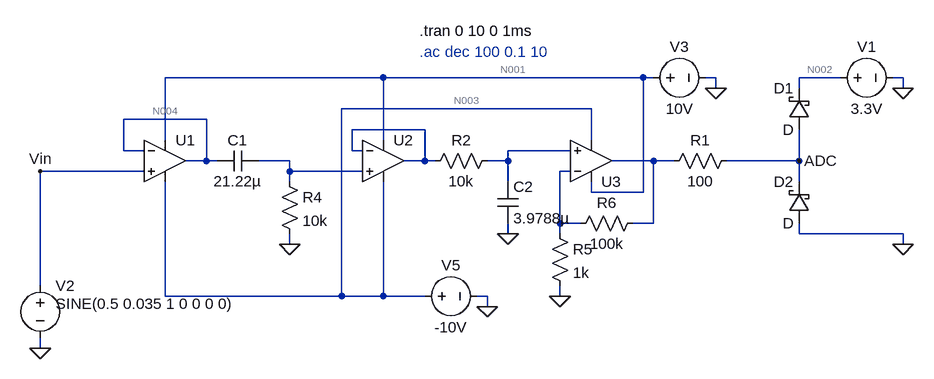
[diagram p0: schematic Lab8.asc]
Lab8.asc, the LTspice schematic file:
Version 4
SHEET 1 880 680
WIRE -128 -48 -464 -48
WIRE 272 -48 -128 -48
WIRE 288 -48 272 -48
WIRE 384 -48 368 -48
WIRE 576 -48 512 -48
WIRE 672 -48 656 -48
WIRE 384 -32 384 -48
WIRE 512 -32 512 -48
WIRE 672 -32 672 -48
WIRE 192 0 -192 0
WIRE -400 16 -528 16
WIRE -64 32 -176 32
WIRE -464 48 -464 -48
WIRE -128 48 -128 -48
WIRE 192 48 192 0
WIRE -528 64 -528 16
WIRE -496 64 -528 64
WIRE -176 64 -176 32
WIRE -160 64 -176 64
WIRE 160 64 64 64
WIRE -400 80 -400 16
WIRE -400 80 -432 80
WIRE -384 80 -400 80
WIRE -272 80 -320 80
WIRE -64 80 -64 32
WIRE -64 80 -96 80
WIRE -48 80 -64 80
WIRE 64 80 64 64
WIRE 64 80 32 80
WIRE 288 80 224 80
WIRE 320 80 288 80
WIRE 512 80 512 32
WIRE 512 80 400 80
WIRE -496 96 -656 96
WIRE -272 96 -272 80
WIRE -160 96 -272 96
WIRE 160 96 144 96
WIRE -272 112 -272 96
WIRE 64 112 64 80
WIRE 512 112 512 80
WIRE 192 128 192 112
WIRE 272 128 272 -48
WIRE 272 128 192 128
WIRE 144 176 144 96
WIRE 176 176 144 176
WIRE 288 176 288 80
WIRE 288 176 256 176
WIRE 64 192 64 176
WIRE 144 192 144 176
WIRE 512 192 512 176
WIRE 672 192 512 192
WIRE -272 208 -272 192
WIRE 672 208 672 192
WIRE -656 272 -656 96
WIRE -464 288 -464 112
WIRE -192 288 -192 0
WIRE -192 288 -464 288
WIRE -128 288 -128 112
WIRE -128 288 -192 288
WIRE -64 288 -128 288
WIRE 32 288 16 288
WIRE 144 288 144 272
WIRE 32 304 32 288
WIRE -656 368 -656 352
FLAG 672 208 0
FLAG 672 -32 0
FLAG -272 208 0
FLAG 64 192 0
FLAG 144 288 0
FLAG 512 80 ADC
FLAG 384 -32 0
FLAG 32 304 0
FLAG -656 368 0
FLAG -656 96 Vin
SYMBOL schottky 528 176 R180
WINDOW 0 24 64 Left 2
WINDOW 3 24 0 Left 2
SYMATTR InstName D2
SYMBOL schottky 528 32 R180
WINDOW 0 24 64 Left 2
WINDOW 3 24 0 Left 2
SYMATTR InstName D1
SYMBOL res 416 64 R90
WINDOW 0 0 56 VBottom 2
WINDOW 3 32 56 VTop 2
SYMATTR InstName R1
SYMATTR Value 100
SYMBOL voltage 560 -48 R270
WINDOW 0 32 56 VTop 2
WINDOW 3 -32 56 VBottom 2
SYMATTR InstName V1
SYMATTR Value 3.3V
SYMBOL voltage -656 256 R0
WINDOW 123 24 124 Left 2
WINDOW 39 0 0 Left 0
WINDOW 3 24 44 Left 2
SYMATTR Value SINE(0.5 0.035 1 0 0 0 0)
SYMATTR InstName V2
SYMBOL OpAmps\\UniversalOpAmp -464 80 R0
SYMATTR InstName U1
SYMBOL OpAmps\\UniversalOpAmp -128 80 R0
SYMATTR InstName U2
SYMBOL res 48 64 R90
WINDOW 0 0 56 VBottom 2
WINDOW 3 32 56 VTop 2
SYMATTR InstName R2
SYMATTR Value 10k
SYMBOL cap -320 64 R90
WINDOW 0 0 32 VBottom 2
WINDOW 3 32 32 VTop 2
SYMATTR InstName C1
SYMATTR Value 21.22µ
SYMBOL res -288 96 R0
SYMATTR InstName R4
SYMATTR Value 10k
SYMBOL cap 48 112 R0
SYMATTR InstName C2
SYMATTR Value 3.9788µ
SYMBOL OpAmps\\UniversalOpAmp 192 80 M180
SYMATTR InstName U3
SYMBOL res 128 176 R0
SYMATTR InstName R5
SYMATTR Value 1k
SYMBOL res 272 160 R90
WINDOW 0 0 56 VBottom 2
WINDOW 3 32 56 VTop 2
SYMATTR InstName R6
SYMATTR Value 100k
SYMBOL voltage 272 -48 R270
WINDOW 0 32 56 VTop 2
WINDOW 3 -32 56 VBottom 2
SYMATTR InstName V3
SYMATTR Value 10V
SYMBOL voltage -80 288 R270
WINDOW 0 32 56 VTop 2
WINDOW 3 -32 56 VBottom 2
SYMATTR InstName V5
SYMATTR Value -10V
TEXT -72 -120 Left 2 !.tran 0 10 0 1ms
TEXT -72 -88 Left 2 ;.ac dec 100 0.1 10

The netlist it stands for:
* Lab8.asc
D2 0 ADC D
D1 ADC N002 D
R1 ADC N008 100
V1 N002 0 3.3V
V2 Vin 0 SINE(0.5 0.035 1 0 0 0 0)
XU1 Vin N004 N001 N003 N004 level1 Avol=1Meg GBW=10Meg Vos=0 En=0 Enk=0 In=0 Ink=0 Rin=500Meg  ; pins In+ In- V+ V- OUT
XU2 N007 N005 N001 N003 N005 level1 Avol=1Meg GBW=10Meg Vos=0 En=0 Enk=0 In=0 Ink=0 Rin=500Meg  ; pins In+ In- V+ V- OUT
R2 N006 N005 10k
C1 N007 N004 21.22µ
R4 N007 0 10k
C2 N006 0 3.9788µ
XU3 N006 N009 N001 N003 N008 level1 Avol=1Meg GBW=10Meg Vos=0 En=0 Enk=0 In=0 Ink=0 Rin=500Meg  ; pins In+ In- V+ V- OUT
R5 N009 0 1k
R6 N008 N009 100k
V3 N001 0 10V
V5 N003 0 -10V
.model D D
.lib standard.dio
.tran 0 10 0 1ms
* .ac dec 100 0.1 10
.lib UniversalOpAmp1.lib
.backanno
.end

* Results of the author's LTspice run, read from the files saved beside the schematic
* Operating Point, zero values left out:
*   V(n002) = 3.3 V
*   V(vin) = 500 mV
*   V(n004) = 500 mV
*   V(n001) = 10 V
*   V(n003) = -10 V
*   I(D1) = -3.31 pA
*   I(R1) = 3.31 pA
*   I(V1) = -3.31 pA
*   I(V2) = -1 nA
*   I(V3) = -59 nA
*   I(V5) = 61 nA
*   Ix(u1:1) = 1 nA
*   Ix(u1:2) = 1 nA
*   Ix(u1:3) = 19 nA
*   Ix(u1:4) = -21 nA
*   Ix(u1:5) = -655.4 pA
*   Ix(u2:3) = 20 nA
*   Ix(u2:4) = -20 nA
*   Ix(u2:5) = 1.061 pA
*   Ix(u3:3) = 20 nA
*   Ix(u3:4) = -20 nA
*   Ix(u3:5) = -1.756 nA
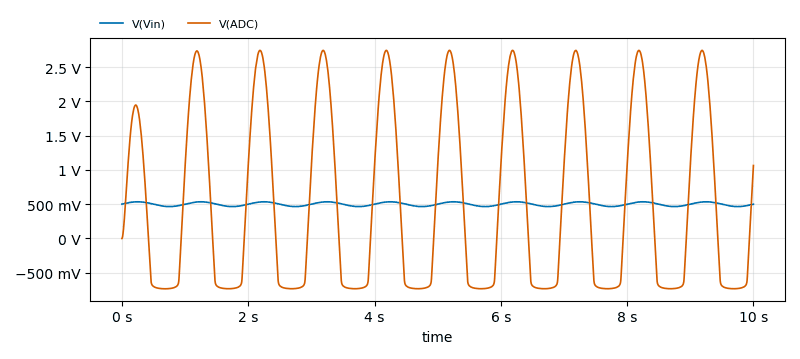
[diagram p1: Transient Analysis of Lab8.asc, plotted from the saved traces]
* Transient Analysis, 1 run:
*   V(Vin): min 465 mV, max 535 mV, average 500 mV, rms 500.6 mV, last 500 mV
*   V(ADC): min -733.8 mV, max 2.743 V, average 508.2 mV, rms 1.414 V, last 1.065 V